# Altium schematic sheet S3C_IOs3V3.SchDoc
size A4; Organization: UltraZohm; SheetNumber: 9
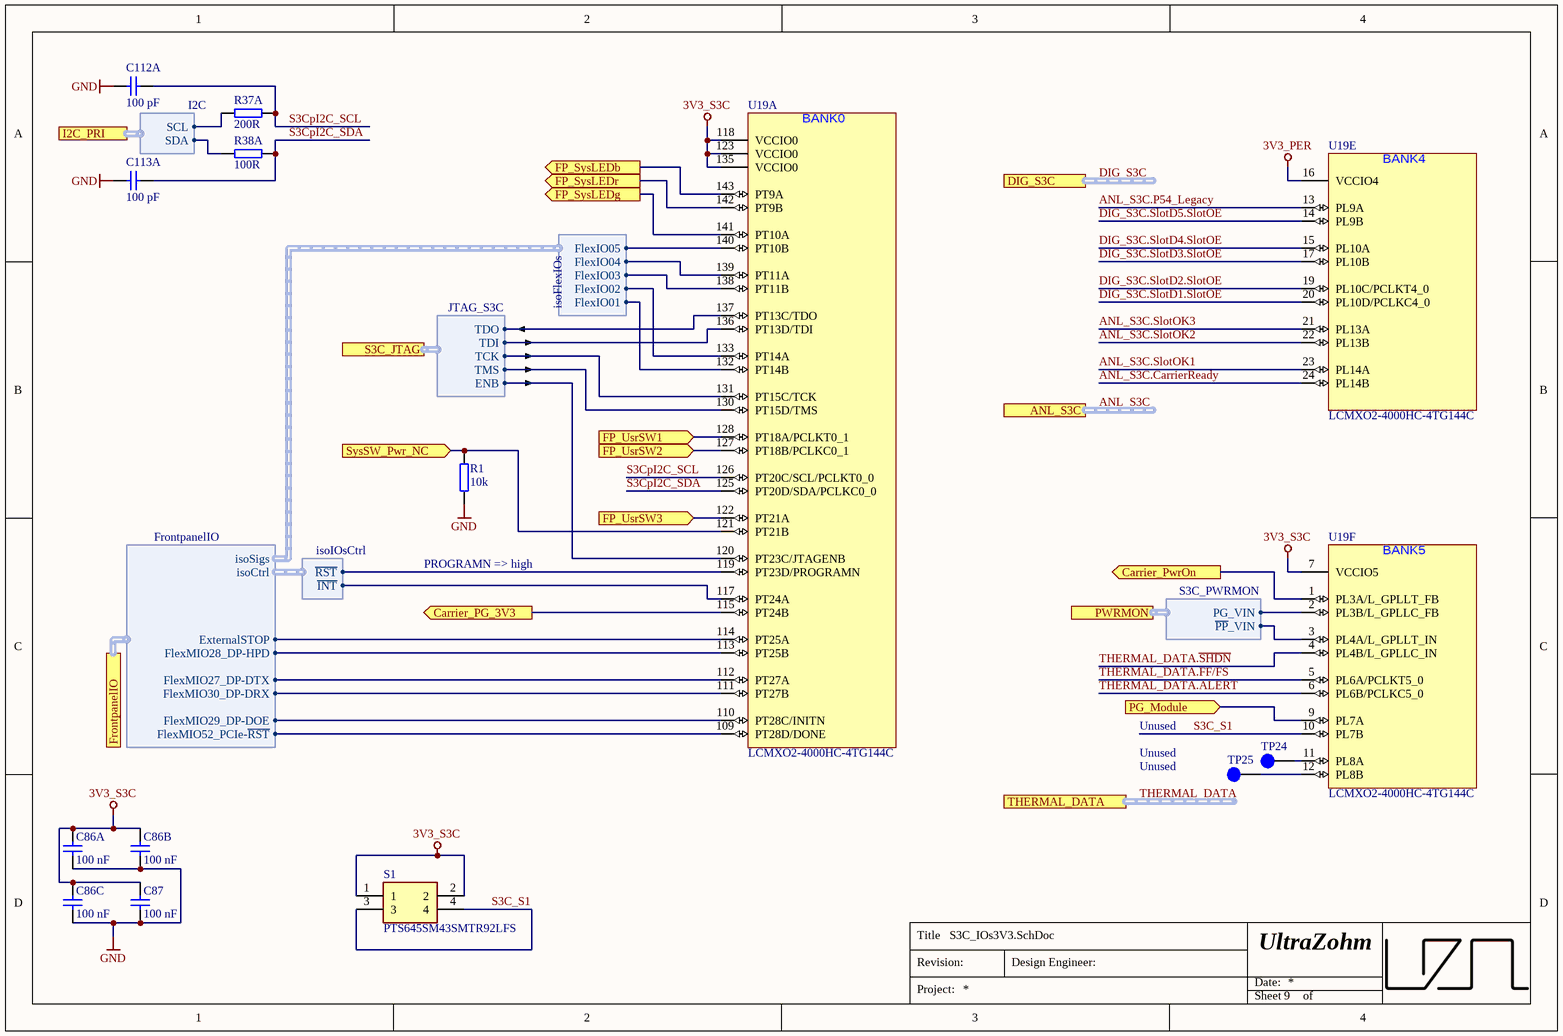
[diagram p0: S3C_IOs3V3.SchDoc]

## Parts
C86A  100 nF  [C_0603_TE]
C86B  100 nF  [C_0603_TE]
C86C  100 nF  [C_0603_TE]
C87  100 nF  [C_0603_TE]
C112A  100 pF  [C_0603_TE]
C113A  100 pF  [C_0603_TE]
R1  10k  [R_0603_TE]
R37A  200R  [R_0603_TE]
R38A  100R  [R_0603_TE]
S1  PTS645SM43SMTR92LFS  [PTS645_SMT]
TP24  Testpoint 1mm  [TP_1mm]  (value not drawn)  (no BOM)
TP25  Testpoint 1mm  [TP_1mm]  (value not drawn)  (no BOM)
U19  LCMXO2-4000HC-4TG144C  [QFP50P2200X2200X160-144N]  (parts A,E,F of 7)

## Ports
ANL_S3C (harness ANL_S3C), Carrier_PG_3V3 (out), Carrier_PwrOn (out), DIG_S3C (harness DIG_S3C), FP_SysLEDb (out), FP_SysLEDg (out), FP_SysLEDr (out), FP_UsrSW1 (in), FP_UsrSW2 (in), FP_UsrSW3 (in), FrontpanelIO (harness FrontpanelIO), I2C_PRI (harness I2C), PG_Module (in), PWRMON (harness S3C_PWRMON), S3C_JTAG (harness JTAG_S3C), SysSW_Pwr_NC (in), THERMAL_DATA (harness T_DATA)

## Harnesses
JTAG_S3C: TDO, TDI, TCK, TMS, ENB
I2C: SCL, SDA
FrontpanelIO: FlexMIO27_DP-DTX, FlexMIO28_DP-HPD, FlexMIO29_DP-DOE, FlexMIO30_DP-DRX, FlexMIO52_PCIe-~{RST}, isoSigs, isoCtrl, ExternalSTOP
isoFlexIOs: FlexIO01, FlexIO02, FlexIO03, FlexIO04, FlexIO05
isoIOsCtrl: ~{RST}, ~{INT}
S3C_PWRMON: PG_VIN, ~{PP}_VIN

## Nets
3V3_PER: U19.16(VCCIO4)
3V3_S3C: C86A.2 C86B.2 C86C.2 C87.2 S1.1 S1.2 U19.7(VCCIO5) U19.118(VCCIO0) U19.123(VCCIO0) U19.135(VCCIO0)
GND: C86A.1 C86B.1 C86C.1 C87.1 C112A.2 C113A.2 R1.1
ANL_S3C.CarrierReady: U19.24(PL14B)
ANL_S3C.P54_Legacy: U19.13(PL9A)
ANL_S3C.SlotOK1: U19.23(PL14A)
ANL_S3C.SlotOK2: U19.22(PL13B)
ANL_S3C.SlotOK3: U19.21(PL13A)
Carrier_PG_3V3: U19.115(PT24B) ; port Carrier_PG_3V3
Carrier_PwrOn: U19.1(PL3A/L_GPLLT_FB) ; port Carrier_PwrOn
DIG_S3C.SlotD1.SlotOE: U19.20(PL10D/PCLKC4_0)
DIG_S3C.SlotD2.SlotOE: U19.19(PL10C/PCLKT4_0)
DIG_S3C.SlotD3.SlotOE: U19.17(PL10B)
DIG_S3C.SlotD4.SlotOE: U19.15(PL10A)
DIG_S3C.SlotD5.SlotOE: U19.14(PL9B)
FP_SysLEDb: U19.143(PT9A) ; port FP_SysLEDb
FP_SysLEDg: U19.141(PT10A) ; port FP_SysLEDg
FP_SysLEDr: U19.142(PT9B) ; port FP_SysLEDr
FP_UsrSW1: U19.128(PT18A/PCLKT0_1) ; port FP_UsrSW1
FP_UsrSW2: U19.127(PT18B/PCLKC0_1) ; port FP_UsrSW2
FP_UsrSW3: U19.122(PT21A) ; port FP_UsrSW3
PG_Module: U19.9(PL7A) ; port PG_Module
S3C_S1: S1.3 S1.4 U19.10(PL7B)
S3CpI2C_SCL: C112A.1 R37A.2 U19.126(PT20C/SCL/PCLKT0_0)
S3CpI2C_SDA: C113A.1 R38A.2 U19.125(PT20D/SDA/PCLKC0_0)
SysSW_Pwr_NC: R1.2 U19.121(PT21B) ; port SysSW_Pwr_NC
THERMAL_DATA.~{ALERT}: U19.6(PL6B/PCLKC5_0)
THERMAL_DATA.~{FF/FS}: U19.5(PL6A/PCLKT5_0)
THERMAL_DATA.~{SHDN}: U19.4(PL4B/L_GPLLC_IN)
NetR37A_1: R37A.1 ; port I2C_PRI.SCL
NetR38A_1: R38A.1 ; port I2C_PRI.SDA
NetTP24_1: TP24.1 U19.11(PL8A)
NetTP25_1: TP25.1 U19.12(PL8B)
NetU19_2: U19.2(PL3B/L_GPLLC_FB) ; port PWRMON.PG_VIN
NetU19_3: U19.3(PL4A/L_GPLLT_IN) ; port PWRMON.~{PP}_VIN
NetU19_114: U19.114(PT25A) ; port FrontpanelIO.ExternalSTOP
NetU19_117: U19.117(PT24A) ; harness isoIOsCtrl.~{INT}
NetU19_119: U19.119(PT23D/PROGRAMN) ; harness isoIOsCtrl.~{RST}
NetU19_120: U19.120(PT23C/JTAGENB) ; port S3C_JTAG.ENB
NetU19_130: U19.130(PT15D/TMS) ; port S3C_JTAG.TMS
NetU19_131: U19.131(PT15C/TCK) ; port S3C_JTAG.TCK
NetU19_132: U19.132(PT14B) ; harness isoFlexIOs.FlexIO01
NetU19_133: U19.133(PT14A) ; harness isoFlexIOs.FlexIO02
NetU19_136: U19.136(PT13D/TDI) ; port S3C_JTAG.TDI
NetU19_137: U19.137(PT13C/TDO) ; port S3C_JTAG.TDO
NetU19_138: U19.138(PT11B) ; harness isoFlexIOs.FlexIO03
NetU19_139: U19.139(PT11A) ; harness isoFlexIOs.FlexIO04
NetU19_140: U19.140(PT10B) ; harness isoFlexIOs.FlexIO05

Not connected (* = marked no-connect by the designer): U19 109(PT28D/DONE) 110(PT28C/INITN) 111(PT27B) 112(PT27A) 113(PT25B)

## Buses and harness runs
harness ANL_S3C = port ANL_S3C
harness DIG_S3C = port DIG_S3C
harness THERMAL_DATA = port THERMAL_DATA

## Notes on the sheet
- PROGRAMN => high
- Unused
- Title
- Revision:
- Design Engineer:
- Date:
- Project:
- Sheet
- of
- (in symbol LCMXO2-4000HC-4TG144C, part A) BANK0
- (in symbol LCMXO2-4000HC-4TG144C, part E) BANK4
- (in symbol LCMXO2-4000HC-4TG144C, part F) BANK5

## Library data of the parts
C86A C86B C86C C87 = UZgen_C_0603_100nF_50V_X7R: Generic capacitor; Manufacturer: UZgen; Tolerance: 10 %; Voltage: 50 V; Created from: AGeiger; Value: 100 nF; Technology: X7R; Manufacturer Part Number: UZgen_C_0603_100nF_50V_X7R; PartID: 1; Created On: 02/07/2024 14:42:23; Device Package: 0603; Mounting Type: SMD; Last Updated: 02/08/2024 14:45:57
C112A C113A = UZgen_C_0603_100pF_50V_X7R: Generic capacitor; Manufacturer: UZgen; Voltage: 50V; Tolerance: 10 %; Created from: UZgenTool; Manufacturer Part Number: UZgen_C_0603_100pF_50V_X7R; PartID: 4215; Created On: 02/08/2024 11:18:08; Value: 100 pF; Device Package: 0603; Technology: X7R; Mounting Type: SMD; Last Updated: 02/08/2024 11:18:08
R1 = UZgen_R_0603_10k: Generic resistor; Manufacturer: UZgen; Tolerance: 1 %; Created from: AGeiger; Manufacturer Part Number: UZgen_R_0603_10k; PartID: 1; Created On: 02/07/2024 14:34:53; Value: 10k; Device Package: 0603; Mounting Type: SMD; Last Updated: 02/07/2024 14:37:16
R37A = UZgen_R_0603_200R: Generic resistor; Manufacturer: UZgen; Tolerance: 1 %; Created from: UZgenTool; Manufacturer Part Number: UZgen_R_0603_200R; PartID: 204; Created On: 02/07/2024 17:29:49; Value: 200R; Device Package: 0603; Mounting Type: SMD; Last Updated: 02/07/2024 17:29:49
R38A = UZgen_R_0603_100R: Generic resistor; Manufacturer: UZgen; Tolerance: 1 %; Created from: UZgenTool; Manufacturer Part Number: UZgen_R_0603_100R; PartID: 197; Created On: 02/07/2024 17:29:48; Value: 100R; Device Package: 0603; Mounting Type: SMD; Last Updated: 02/07/2024 17:29:48
S1 = PTS645SM43SMTR92LFS: 50mA SPST 160gf 12V SMD-4P,6x6mm Tactile Switches ROHS; Manufacturer_Name: C & K COMPONENTS; Manufacturer: C&K COMPONENTS; Value: Push Button; Created from: AGeiger; Datasheet Link: https://www.ckswitches.com/media/1471/pts645.pdf; Manufacturer_Part_Number: PTS645SM43SMTR92LFS; Mouser Part Number: 611-PTS645SM43SMTR92; Mouser Price/Stock: https://www.mouser.co.uk/ProductDetail/CK/PTS645SM43SMTR92LFS?qs=FESYatJ8odKPktxv6ncfWg%3D%3D; Arrow Part Number: PTS645SM43SMTR92LFS; Arrow Price/Stock: https://www.arrow.com/en/products/pts645sm43smtr92lfs/ck; Manufacturer Part Number: PTS645SM43SMTR92LFS; PartID: 24; Created On: 31/05/2023 15:31:02; ComponentLink1Description: Datasheet; ComponentLink1URL: https://datasheet.lcsc.com/lcsc/1810121628_C-K-PTS645SM43SMTR92LFS_C221880.pdf; Component Type: Tactile Switch; Device Package: SMD; Last Updated: 31/05/2023 15:31:02; Mounting Type: SMD; Operating Temperature: -20 to +60 °C; Supplier 1: Mouser; Supplier Part Number 1: 611-PTS645SM43SMTR92; Supplier 2: LCSC; Supplier Part Number 2: C221880; Type: Tactile Switch; Live Cycle Status: 1; LCSC Part Number: C221880
TP24 TP25 = NULL: Manufacturer Part Number: NULL; Created from: AGeiger; Created: 2018_06_25_AGeiger; Value: Testpoint 1mm; PartID: 9; Created On: 20/09/2022 13:14:57; Component Type: Testpoint; Last Updated: 20/09/2022 13:15:39; Manufacturer: NULL; Supplier 1: NULL; Supplier Part Number 1: NULL; Type: Testpoint; Live Cycle Status: 1
U19 = LCMXO2-4000HC-4TG144C: TQFP-144(20x20) Programmable Logic Device (CPLDs/FPGAs) ROHS; Manufacturer: Lattice; Created from: FRosner; Manufacturer Part Number: LCMXO2-4000HC-4TG144C; PartID: 38; Created On: 03/07/2024 17:33:36; ComponentLink1Description: Datasheet; ComponentLink1URL: https://wmsc.lcsc.com/wmsc/upload/file/pdf/v2/lcsc/2403111456_Lattice-LCMXO2-4000HC-4TG144C_C1521625.pdf; Component Type: CPLD; Device Package: TQFP-144; Last Updated: 23/08/2024 11:42:29; Mounting Type: SMD; Operating Temperature: -0 to +85 °C; Supplier 1: LCSC; Supplier Part Number 1: C1521625; Supplier 2: Mouser; Supplier Part Number 2: 842-XO24000HC4TG144C; Type: CPLD; Live Cycle Status: 1; LCSC Part Number: C1521625; Stock number: not stored